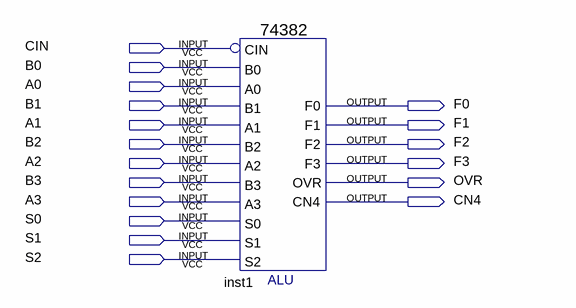
[diagram p0: schematic sheet]
// Quartus schematic a3.bdf as structural Verilog: 1 symbols, 18 pins
module a3 (
  input  CIN,
  input  B0,
  input  A0,
  input  B1,
  input  A1,
  input  B2,
  input  A2,
  input  B3,
  input  A3,
  input  S0,
  input  S1,
  input  S2,
  output F0,
  output F1,
  output F2,
  output F3,
  output OVR,
  output CN4
);

  \74382  inst1 (
    .B3(B3), .A3(A3), .B0(B0), .A0(A0), .B1(B1), .S2(S2), .S1(S1), .S0(S0), .A1(A1), .B2(B2), .A2(A2),
    .CIN(CIN), .F1(F1), .F0(F0), .CN4(CN4), .F3(F3), .F2(F2), .OVR(OVR));
endmodule
